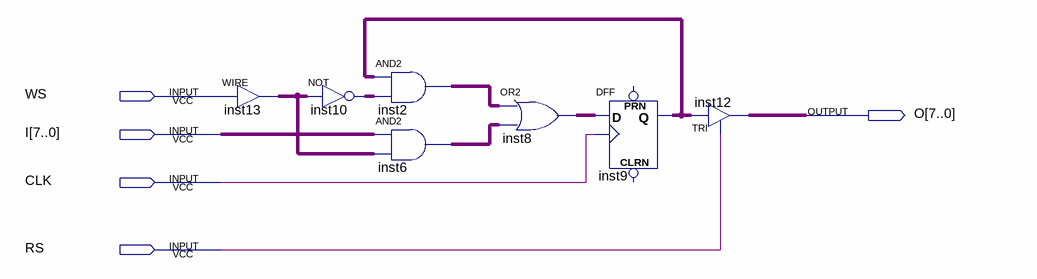
[diagram p0: schematic sheet]
// Quartus schematic RFC.bdf as structural Verilog: 7 symbols, 5 pins
module RFC (
  input  WS,
  input  [7:0] I,
  input  CLK,
  input  RS,
  output [7:0] O
);

  wire [7:0] inst2_out, inst6_out, inst8_out, inst9_q, inst10_out, inst13_out;

  assign inst13_out = {8{WS}};  // WIRE inst13
  assign inst10_out = ~inst13_out;  // NOT inst10, 8 bits wide
  assign inst2_out = inst9_q & inst10_out;  // AND2 inst2, 8 bits wide
  assign inst6_out = I & inst13_out;  // AND2 inst6, 8 bits wide
  assign inst8_out = inst2_out | inst6_out;  // OR2 inst8, 8 bits wide
  DFF inst9[7:0] (.CLK(CLK), .D(inst8_out), .Q(inst9_q));  // open: CLRN, PRN
  TRI inst12[7:0] (.IN(inst9_q), .OE(RS), .OUT(O));
endmodule
